# Altium schematic sheet ElectroPlantoE.SchDoc
size A
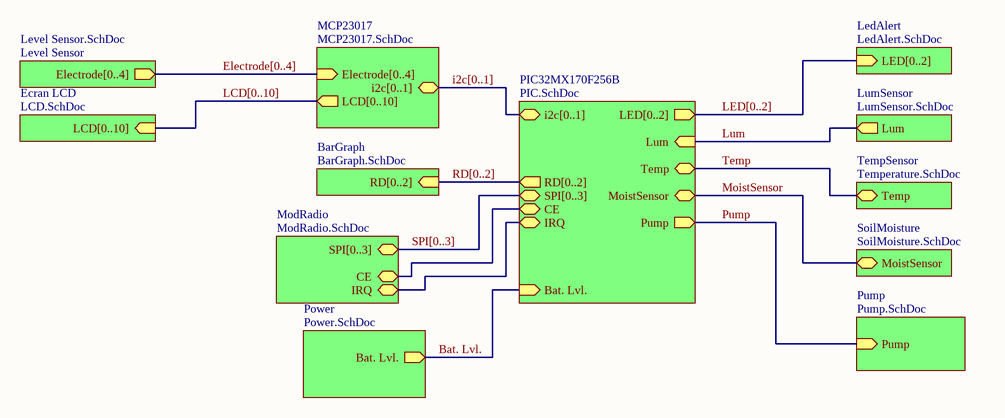
[diagram p0: ElectroPlantoE.SchDoc]

## Sub-sheets
BarGraph = BarGraph.SchDoc: RD[0..2] (in)
Ecran LCD = LCD.SchDoc: LCD[0..10] (in)
LedAlert = LedAlert.SchDoc: LED[0..2] (in)
Level Sensor = Level Sensor.SchDoc: Electrode[0..4] (out)
LumSensor = LumSensor.SchDoc: Lum (out)
MCP23017 = MCP23017.SchDoc: i2c[0..1] (bidir), Electrode[0..4] (in), LCD[0..10] (out)
ModRadio = ModRadio.SchDoc: SPI[0..3], CE, IRQ
PIC32MX170F256B = PIC.SchDoc: LED[0..2] (out), Lum (in), Temp (bidir), i2c[0..1] (bidir), RD[0..2] (out), MoistSensor (bidir), Pump (out), SPI[0..3], CE, Bat. Lvl. (in), IRQ
Power = Power.SchDoc: Bat. Lvl. (out)
Pump = Pump.SchDoc: Pump (in)
SoilMoisture = SoilMoisture.SchDoc: MoistSensor (bidir)
TempSensor = Temperature.SchDoc: Temp (bidir)

## Nets
Bat. Lvl.: sheet PIC32MX170F256B/Bat. Lvl., sheet Power/Bat. Lvl.
Lum: sheet PIC32MX170F256B/Lum, sheet LumSensor/Lum
MoistSensor: sheet PIC32MX170F256B/MoistSensor, sheet SoilMoisture/MoistSensor
Pump: sheet PIC32MX170F256B/Pump, sheet Pump/Pump
Temp: sheet PIC32MX170F256B/Temp, sheet TempSensor/Temp
(unnamed): sheet PIC32MX170F256B/CE, sheet ModRadio/CE
(unnamed): sheet PIC32MX170F256B/IRQ, sheet ModRadio/IRQ

## Buses and harness runs
bus Electrode[0..4] = sheet Level Sensor/Electrode[0..4] = sheet MCP23017/Electrode[0..4]
bus i2c[0..1] = sheet MCP23017/i2c[0..1] = sheet PIC32MX170F256B/i2c[0..1]
bus LCD[0..10] = sheet Ecran LCD/LCD[0..10] = sheet MCP23017/LCD[0..10]
bus LED[0..2] = sheet LedAlert/LED[0..2] = sheet PIC32MX170F256B/LED[0..2]
bus RD[0..2] = sheet BarGraph/RD[0..2] = sheet PIC32MX170F256B/RD[0..2]
bus SPI[0..3] = sheet ModRadio/SPI[0..3] = sheet PIC32MX170F256B/SPI[0..3]